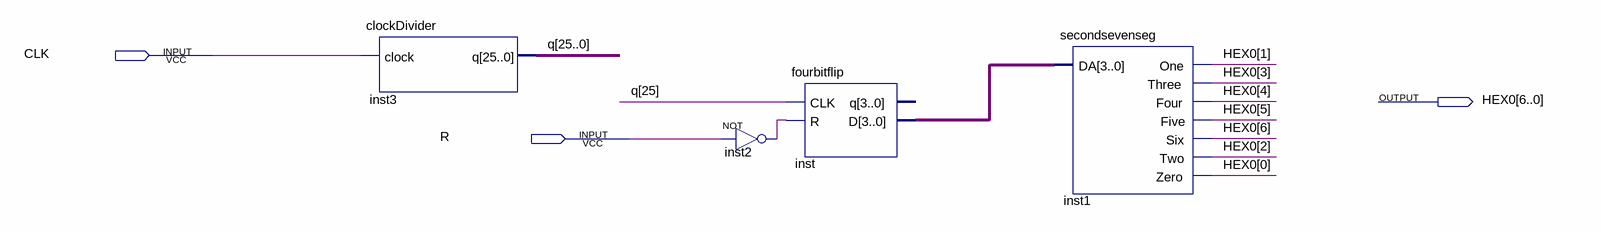
[diagram p0: schematic sheet]
// Quartus schematic deccounter.bdf as structural Verilog: 4 symbols, 3 pins
module deccounter (
  input  CLK,
  input  R,
  output [6:0] HEX0
);

  wire inst2_out;
  wire [3:0] inst_d;
  wire [25:0] q;

  clockDivider inst3 (.clock(CLK), .q(q));
  not inst2 (inst2_out, R);
  fourbitflip inst (.CLK(q[25]), .R(inst2_out), .D(inst_d));  // open: q
  secondsevenseg inst1 (
    .DA(inst_d), .One(HEX0[1]), .Three(HEX0[3]), .Four(HEX0[4]), .Five(HEX0[5]), .Six(HEX0[6]),
    .Two(HEX0[2]), .Zero(HEX0[0]));
endmodule
